# EAGLE design PageTurner-Display (EAGLE 9.6.2)
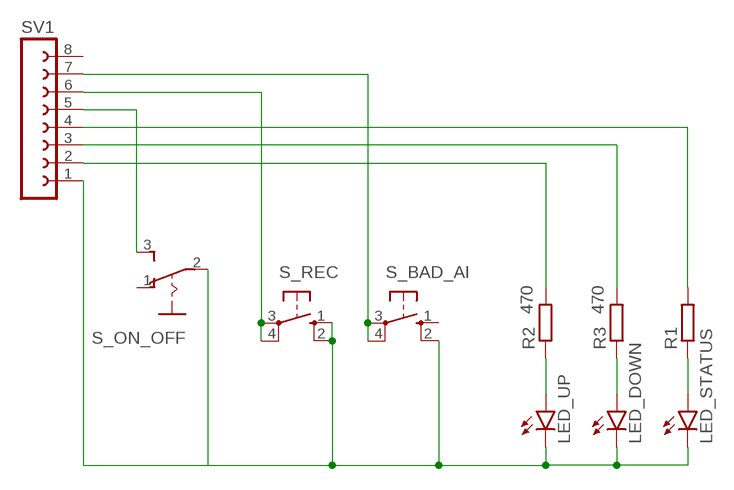
[diagram p0: schematic, sheet 1]

## Parts
LED_DOWN  LED3MM  [LED3MM]
LED_STATUS  LED3MM  [LED3MM]
LED_UP  LED3MM  [LED3MM]
R1  470  R-EU_0207/12  [0207/12]
R2  470  R-EU_0207/12  [0207/12]
R3  470  R-EU_0207/12  [0207/12]
S_BAD_AI  10-XX  [B3F-10XX]
S_ON_OFF  255SB  [255SB]
S_REC  10-XX  [B3F-10XX]
SV1  FE08-1  [FE08]

## Nets
N$1: S_BAD_AI.3(P) S_BAD_AI.4(P1) SV1.7
N$2: S_ON_OFF.3(S) SV1.5
N$4: LED_DOWN.A R3.1
N$5: LED_UP.A R2.1
N$6: LED_STATUS.A R1.1
N$7: LED_DOWN.K(C) LED_STATUS.K(C) LED_UP.K(C) S_BAD_AI.2(S1) S_ON_OFF.2(P) S_REC.1(S) S_REC.2(S1) SV1.1
N$11: R2.2 SV1.2
N$12: R1.2 SV1.4
N$13: R3.2 SV1.3
N$14: S_REC.3(P) S_REC.4(P1) SV1.6
Unconnected: S_BAD_AI.1(S) S_ON_OFF.1(O) SV1.8

## Library data of the parts
LED_DOWN LED_STATUS LED_UP = led:LED: LED OSRAM: - CHIPLED LG R971, LG N971, LY N971, LG Q971, LY Q971, LO R971, LY R971 LH N974, LH R974 LS Q976, LO Q976, LY Q976 LO Q996 - Hyper CHIPLED LW Q18S LB Q993, LB Q99A, LB R99A - SideLED LS A670, LO A670, LY A670, LG A670, LP A670 LB A673, LV A673, LT A673, LW A673 LH A674 LY A675 LS A676, LA A676, LO A676, LY A676, LW A676 LS A679, LY A679, LG A679 - Hyper Micro SIDELED® LS Y876, LA Y876, LO Y876, LY Y876 LT Y87S - SmartLED LW L88C, LW L88S LB L89C, LB L89S, LG L890 LS L89K, LO L89K, LY L89K LS L896, LA L896, LO L896, LY L896 - TOPLED LS T670, LO T670, LY T670, LG T670, LP T670 LSG T670, LSP T670, LSY T670, LOP T670, LYG T670 LG T671, LOG T671, LSG T671 LB T673, LV T673, LT T673, LW T673 LH T674 LS T676, LA T676, LO T676, LY T676, LB T676, LH T676, LSB T676, LW T676 LB T67C, LV T67C, LT T67C, LS T67K, LO T67K, LY T67K, LW E67C LS E67B, LA E67B, LO E67B, LY E67B, LB E67C, LV E67C, LT E67C LW T67C LS T679, LY T679, LG T679 LS T770, LO T770, LY T770, LG T770, LP T770 LB T773, LV T773, LT T773, LW T773 LH T774 LS E675, LA E675, LY E675, LS T675 LS T776, LA T776, LO T776, LY T776, LB T776 LHGB T686 LT T68C, LB T68C - Hyper Mini TOPLED® LB M676 - Mini TOPLED Santana® LG M470 LS M47K, LO M47K, LY M47K Source: http://www.osram.convergy.de LUXEON: - LUMILED® LXK2-PW12-R00, LXK2-PW12-S00, LXK2-PW14-U00, LXK2-PW14-V00 LXK2-PM12-R00, LXK2-PM12-S00, LXK2-PM14-U00 LXK2-PE12-Q00, LXK2-PE12-R00, LXK2-PE12-S00, LXK2-PE14-T00, LXK2-PE14-U00 LXK2-PB12-K00, LXK2-PB12-L00, LXK2-PB12-M00, LXK2-PB14-N00, LXK2-PB14-P00, LXK2-PB14-Q00 LXK2-PR12-L00, LXK2-PR12-M00, LXK2-PR14-Q00, LXK2-PR14-R00 LXK2-PD12-Q00, LXK2-PD12-R00, LXK2-PD12-S00 LXK2-PH12-R00, LXK2-PH12-S00 LXK2-PL12-P00, LXK2-PL12-Q00, LXK2-PL12-R00 Source: www.luxeon.com KINGBRIGHT: KA-3528ASYC Source: www.kingbright.com
R1-R3 = rcl:R-EU_: RESISTOR, European symbol; SPICEPREFIX: R
S_BAD_AI S_REC = switch-omron:10-XX: OMRON SWITCH; MPN: B3F-1000; OC_FARNELL: 176432; OC_NEWARK: 36M3542
S_ON_OFF = switch:255SB: SLIDING SWITCH Distributor Buerklin, 11G810
SV1 = con-lsta:FE08-1: FEMALE HEADER; OC_FARNELL: unknown; OC_NEWARK: unknown

## Board
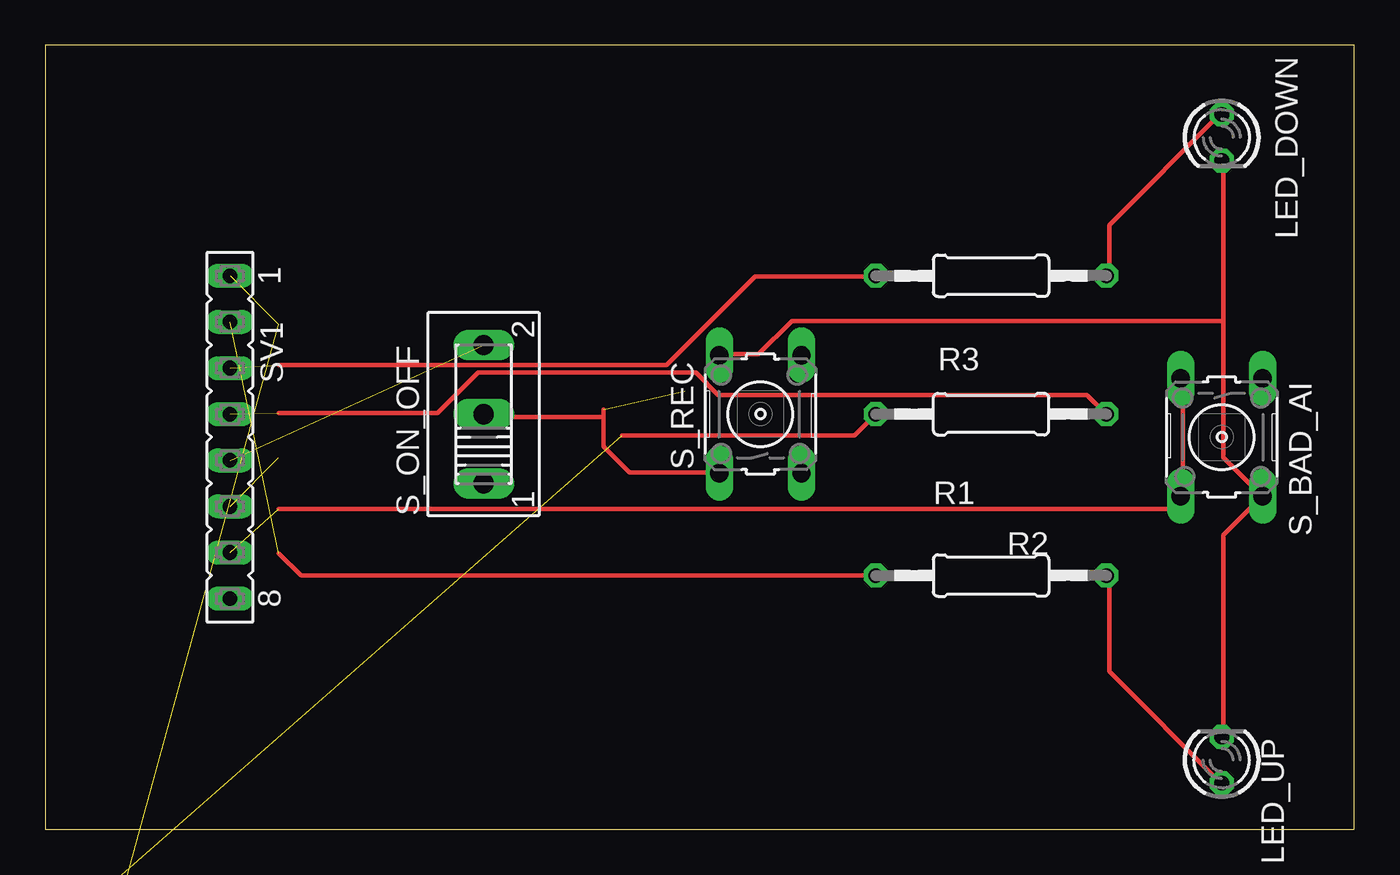
[diagram p1: board, top side]
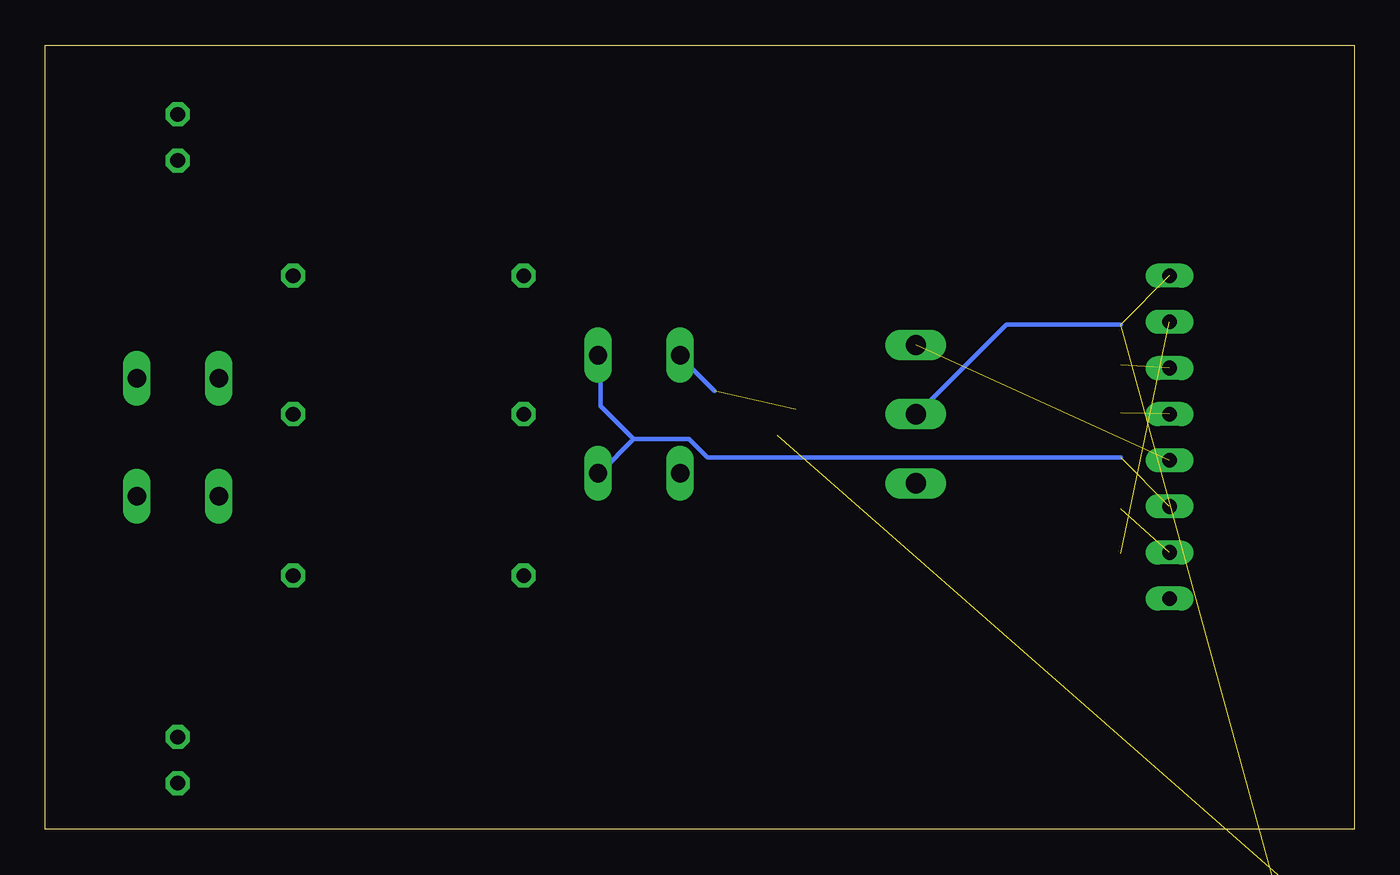
[diagram p2: board, bottom side, seen from below]

Size 72.06 x 43.17 mm. Coordinates in mm from the lower left corner, seen from the top.
Outline: 0,0 72.06,0 72.06,43.17 0,43.17 0,0
Copper layers (1*16): Top 0.035mm / dielectric 1.5mm / Bottom 0.035mm
Design rules "default *": minimum track width 10mil, minimum drill 0.35mm, track to track 6mil, track to pad 6mil, pad to pad 6mil, via to via 6mil, smd to smd 6mil, copper to edge 40mil, drill to drill 6mil, minimum pad ring 10mil, minimum via ring 8mil, stop-mask expansion 4mil, vias tented up to drill 0mil, thermal gap 10mil

### Footprints (pad centres in the part's own frame; a part is rotated, then mirrored left to right if it is on the bottom)
LED3MM = drill 0.813 octagon: A -1.27,0; K 1.27,0
0207/12 = drill 0.813 octagon: 1 -6.35,0; 2 6.35,0
B3F-10XX = drill 1.016 long: 1 -3.251,2.261; 2 3.251,2.261; 3 -3.251,-2.261; 4 3.251,-2.261
255SB = drill 1.118 long: 1 -3.81,0; 2 0,0; 3 3.81,0
FE08 = drill 0.813 long: 1 -8.89,0; 2 -6.35,0; 3 -3.81,0; 4 -1.27,0; 5 1.27,0; 6 3.81,0; 7 6.35,0; 8 8.89,0

### Placement (x,y rotation side)
LED_DOWN  64.77,38.1 270 top
LED_STATUS  2.54,-5.08 0 top  (outside the outline)
LED_UP  64.77,3.81 90 top
R1  52.07,22.86 0 top
R2  52.07,13.97 180 top
R3  52.07,30.48 180 top
S_BAD_AI  64.77,21.59 270 top
S_ON_OFF  24.13,22.86 90 top
S_REC  39.37,22.86 90 top
SV1  10.16,21.59 270 top

### Tracks (layer width: path | path; a pad name or v marks a point on that pad's centre or on a via)
N$1  (1 unrouted)
  Top 0.254: 12.85,17.63 61.82,17.63 62.43,18.24 S_BAD_AI.4 62.64,18.44 62.64,24.74 S_BAD_AI.3
N$2  (1 unrouted)
N$4
  Top 0.254: R3.1 58.57,30.63 58.57,33.27 64.67,39.37 LED_DOWN.A
N$5
  Top 0.254: R2.1 58.57,13.97 58.57,8.69 64.67,2.59 LED_UP.A
N$6  (1 unrouted)
  Top 0.254: 31.75,21.69 44.55,21.69 R1.1
N$7  (3 unrouted)
  Top 0.254: 30.73,23.11 30.73,22.71 | 30.73,22.71 30.73,21.08 32.16,19.66 37.03,19.66 S_REC.1 | 30.73,22.71 24.23,22.71 S_ON_OFF.2 | LED_UP.K 64.87,5.23 64.87,16.2 66.9,18.24 S_BAD_AI.2 66.9,18.44 64.87,20.47 64.87,27.99 | 64.87,27.99 64.87,36.73 LED_DOWN.K | 64.87,27.99 41.1,27.99 39.27,26.16 37.24,26.16 S_REC.2
  Bottom 0.254: 35.2,24.13 37.03,25.96 S_REC.2 | 12.85,27.79 19.15,27.79 24.03,22.91 S_ON_OFF.2
N$11  (1 unrouted)
  Top 0.254: R2.2 14.07,13.97 12.85,15.19
N$12  (1 unrouted)
  Top 0.254: 12.85,22.91 21.59,22.91 23.82,25.15 35.81,25.15 37.03,23.93 57.35,23.93 R1.2
N$13  (1 unrouted)
  Top 0.254: 12.85,25.55 34.19,25.55 39.06,30.43 45.57,30.43 R3.2
N$14  (1 unrouted)
  Bottom 0.254: 12.85,20.47 35.61,20.47 36.63,21.49 39.67,21.49 | 39.67,21.49 41.5,19.66 S_REC.3 | 39.67,21.49 41.5,23.32 41.5,25.96 S_REC.4